# Altium project DO_AN1_project.PrjPCB
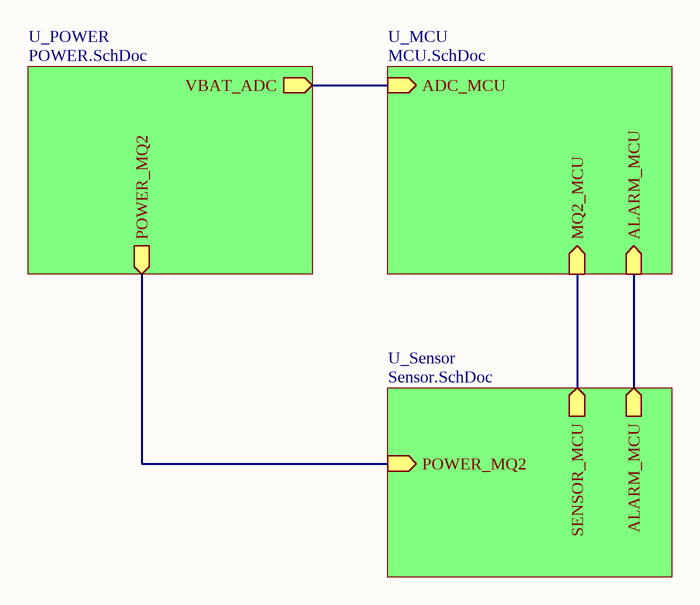
[diagram p0: MutiSheet.SchDoc]
4 sheets, 63 parts. Net scope: hierarchical (ports join the sheet entries above them; power ports are global).
Board files: PCB_DO_AN_1_ver1.PcbDoc, PCB_DO_AN_1_ver2.PcbDoc
Sheets:
  MutiSheet.SchDoc
    U_MCU = MCU.SchDoc
    U_POWER = POWER.SchDoc
    U_Sensor = Sensor.SchDoc

## Sheet MutiSheet.SchDoc
size B

### Sub-sheets
U_MCU = MCU.SchDoc: ADC_MCU (in), ALARM_MCU (in), MQ2_MCU (in)
U_POWER = POWER.SchDoc: VBAT_ADC (out), POWER_MQ2 (out)
U_Sensor = Sensor.SchDoc: ALARM_MCU (out), SENSOR_MCU (out), POWER_MQ2 (in)

### Nets
NetC13#1_2: sheet U_POWER/POWER_MQ2, sheet U_Sensor/POWER_MQ2
NetC14#1_2: sheet U_MCU/ADC_MCU, sheet U_POWER/VBAT_ADC
NetIC1_9: sheet U_MCU/MQ2_MCU, sheet U_Sensor/SENSOR_MCU
NetIC1_33: sheet U_MCU/ALARM_MCU, sheet U_Sensor/ALARM_MCU

## Sheet MCU.SchDoc
size A
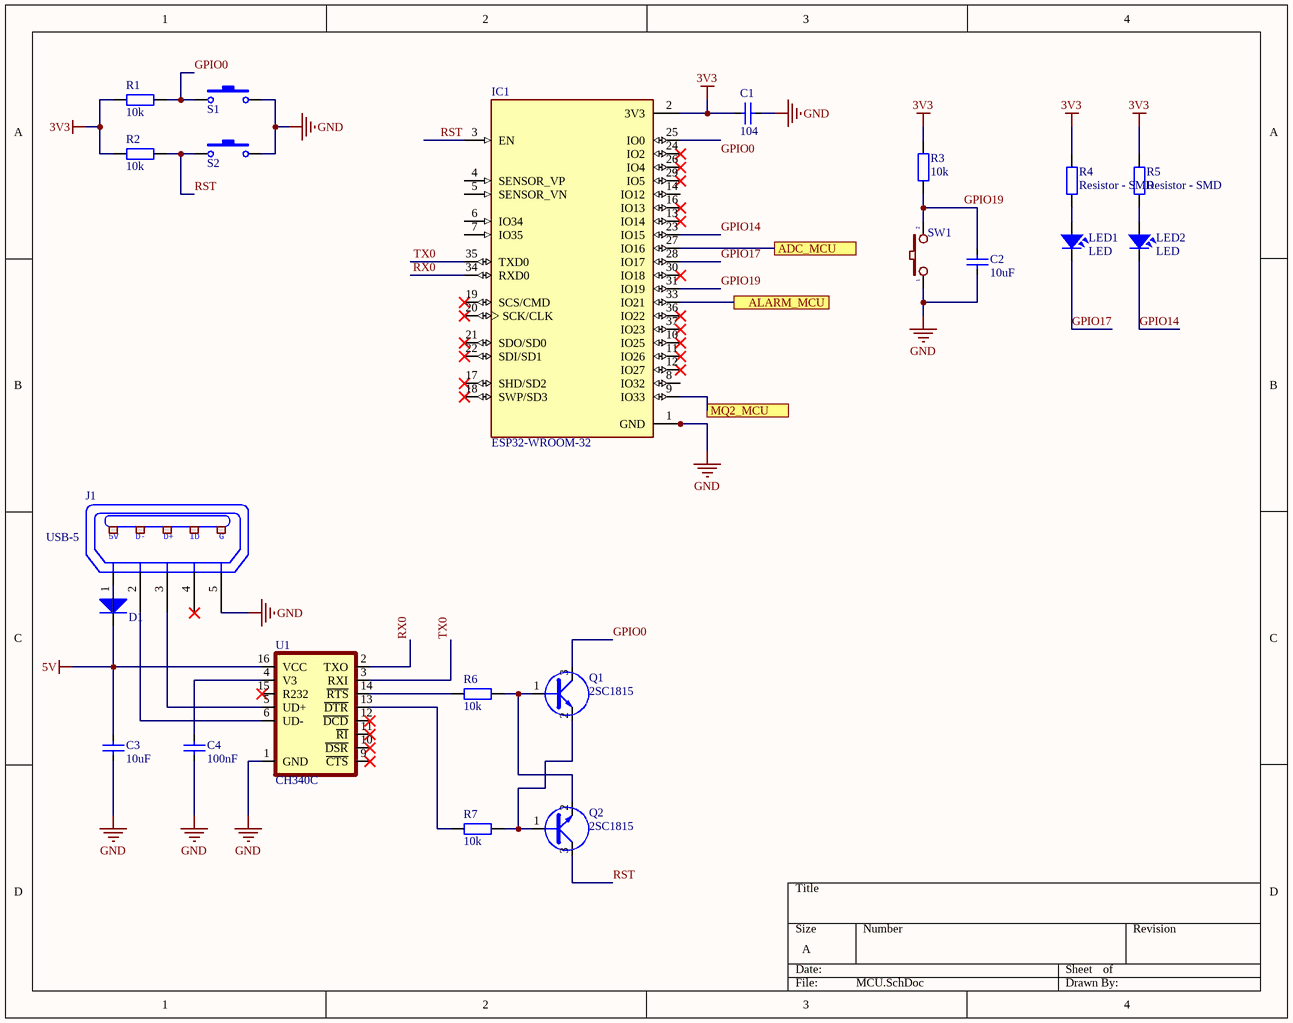
[diagram p1: MCU.SchDoc]

### Parts
C1  104  [CAP_0805]
C2  10uF  [CAP_0805]
C3  10uF  [CAP_0805]
C4  100nF  [CAP_0805]
D1  Diode SMD  [DIO-214AC(SMA)]  (value not drawn)
IC1  ESP32-WROOM-32  [MODULE_ESP32-WROOM-32]
J1  USB-5  [USB-M1]
LED1  LED  [LED-0805-Blue]
LED2  LED  [LED-3]
Q1  2SC1815  [SOT23D]
Q2  2SC1815  [SOT23D]
R1  10k  [RES-SMD-0805]
R2  10k  [RES-SMD-0805]
R3  10k  [RES-SMD-0805]
R4  Resistor - SMD  [RES-SMD-0805]
R5  Resistor - SMD  [RES-SMD-0805]
R6  10k  [RES-SMD-0805]
R7  10k  [RES-SMD-0805]
S1  SW-SMD  [SW 3x2x4]  (value not drawn)
S2  SW-SMD  [SW 3x2x4]  (value not drawn)
SW1  SW  [SW2]  (value not drawn)
U1  CH340C  [SOP-16]

### Ports
ADC_MCU, ALARM_MCU, MQ2_MCU

### Nets
3V3: C1.1 IC1.2(3V3) R1.2 R2.2 R3.1 R4.2 R5.2
5V: C3.2 D1.2(K) U1.16(VCC)
GND: C1.2 C2.1 C3.1 C4.1 IC1.1(GND) IC1.15(GND) IC1.38(GND) IC1.39_1(GND) IC1.39_2(GND) IC1.39_3(GND) IC1.39_4(GND) IC1.39_5(GND) IC1.39_6(GND) IC1.39_7(GND) IC1.39_8(GND) IC1.39_9(GND) IC1.39_10(GND) IC1.39_11(GND) IC1.39_12(GND) IC1.39_13(GND) IC1.39_14(GND) IC1.39_15(GND) IC1.39_16(GND) IC1.39_17(GND) IC1.39_18(GND) IC1.39_19(GND) IC1.39_20(GND) IC1.39_21(GND) J1.5(P5) S1.2 S2.2 SW1.1 U1.1(GND)
GPIO0: IC1.25(IO0) Q1.3(C) R1.1 S1.1
GPIO14: IC1.23(IO15) LED2.2
GPIO17: IC1.28(IO17) LED1.2
GPIO19: C2.2 IC1.31(IO19) R3.2 SW1.2
RST: IC1.3(EN) Q2.3(C) R2.1 S2.1
RX0: IC1.34(RXD0) U1.2(TXO)
TX0: IC1.35(TXD0) U1.3(RXI)
NetC4_2: C4.2 U1.4(V3)
NetC14#1_2: IC1.27(IO16) ; port ADC_MCU
NetD1_1: D1.1(A) J1.1(P1)
NetIC1_9: IC1.9(IO33) ; port MQ2_MCU
NetIC1_33: IC1.33(IO21) ; port ALARM_MCU
NetJ1_2: J1.2(P2) U1.6(UD-)
NetJ1_3: J1.3(P3) U1.5(UD+)
NetLED1_1: LED1.1 R4.1
NetLED2_1: LED2.1 R5.1
NetQ1_1: Q1.1(B) Q2.2(E) R6.1
NetQ1_2: Q1.2(E) Q2.1(B) R7.1
NetR6_2: R6.2 U1.14(~{RTS})
NetR7_2: R7.2 U1.13(~{DTR})

Not connected (* = marked no-connect by the designer): IC1 4(SENSOR_VP) 5(SENSOR_VN) 6(IO34) 7(IO35) 8(IO32) 10(IO25)* 11(IO26)* 12(IO27)* 13(IO14)* 14(IO12) 16(IO13)* 17(SHD/SD2)* 18(SWP/SD3)* 19(SCS/CMD)* 20(SCK/CLK)* 21(SDO/SD0)* 22(SDI/SD1)* 24(IO2)* 26(IO4)* 29(IO5)* 30(IO18)* 36(IO22)* 37(IO23)*; J1 4(P4)*; U1 9(~{CTS})* 10(~{DSR})* 11(~{RI})* 12(~{DCD})* 15(R232)*

### Notes on the sheet
- (in symbol USB-5) 5V; D-; D+; ID; G

### Library data of the parts
C1-C4 = CapSMD: Capacitor; Value: 33p; Published: 8-Jun-2000; LatestRevisionDate: 17-Jul-2002; LatestRevisionNote: Re-released for DXP Platform.; PackageReference: RAD-0.3; Publisher: Altium Limited
D1 = Diode SMD: Default Diode; Code - JEDEC: DO-214-AB; Value: 1N5007; Published: 8-Jun-2000; Revision: July-2002: Re-released for DXP Platform.; Publisher: Altium Limited
IC1 = ESP32-WROOM-32: Bluetooth, WiFi Transceiver Module 2.4GHz ~ 2.5GHz Surface Mount; MF: Espressif Systems; Package: Module Espressif Systems; Digi-Key_Part_Number: 1904-1010-1-ND; Digi-Key_Purchase_URL: https://www.digikey.com/product-detail/en/espressif-systems/ESP32-WROOM-32/1904-1010-1-ND/8544305?utm_source=snapeda&utm_medium=aggregator&utm_campaign=symbol; Value: *; MP: ESP32-WROOM-32; SnapEDA_Link: https://www.snapeda.com/parts/ESP32-WROOM-32/Espressif%20Systems/view-part/2753322/?ref=snap
J1 = USB-5: Manufacturer: FCI; Manufacturer Part Number: 10118193-0001LF; Connector Type: USB - micro B; Number of Contacts: 5; Gender: Receptacle; Specifications: USB 2.0; .Creator: MM; .Checked PCB: RF; Supplier 1: Digi-Key; RoHS: RoHS Compliant; Category: Connectors, Interconnects; Stock 1: 28642; Pricing 1: 1=0.46, 10=0.433, 25=0.3712, 50=0.3156, 100=0.3032, 250=0.27224, 500=0.25988 (USD); Packaging: Cut Tape (CT); Mounting Type: Surface Mount, Right Angle, Horizontal; Features: Shielded, Solder Retention; Ingress Protection: -; ComponentLink1URL: http://portal.fciconnect.com/Comergent//fci/drawing/10118193.pdf; ComponentLink1Description: http://portal.fciconnect.com/Comergent//fci/drawing/10118193.pdf; Supplier Part Number 1: 609-4616-1-ND; .Checked SCH: MM
LED1 LED2 = LED: LED Single colour Green and Red; Value: LED 3 ly Single Colour
Q1 Q2 = C1815: NPN 600mW, ECB; Value: C1815
R1-R7 = Resistor - SMD: Resistor SMD; Manufacturer: Generic Components; Class: Passive; Published: 08/06/2000; Publisher: Altium Hobart Technology Centre
S1 S2 = SW-SMD: Switch; Published: 24-Mar-1999; LatestRevisionDate: 17-Jul-2002; LatestRevisionNote: Re-released for DXP Platform.; PackageReference: SPST-2; Publisher: Altium Limited
SW1 = SW2: Switch button 2 pin; Value: SW chip 2 pin
U1 = CH340C: USB to serial chip CH340; MF: WCH; Package: Package; Check_prices: https://www.snapeda.com/parts/CH340C/WCH/view-part/5428851/?ref=eda; Value: *; Price: None; MP: CH340C; Availability: Unavailable; SnapEDA_Link: https://www.snapeda.com/parts/CH340C/WCH/view-part/5428851/?ref=snap

## Sheet POWER.SchDoc
size B
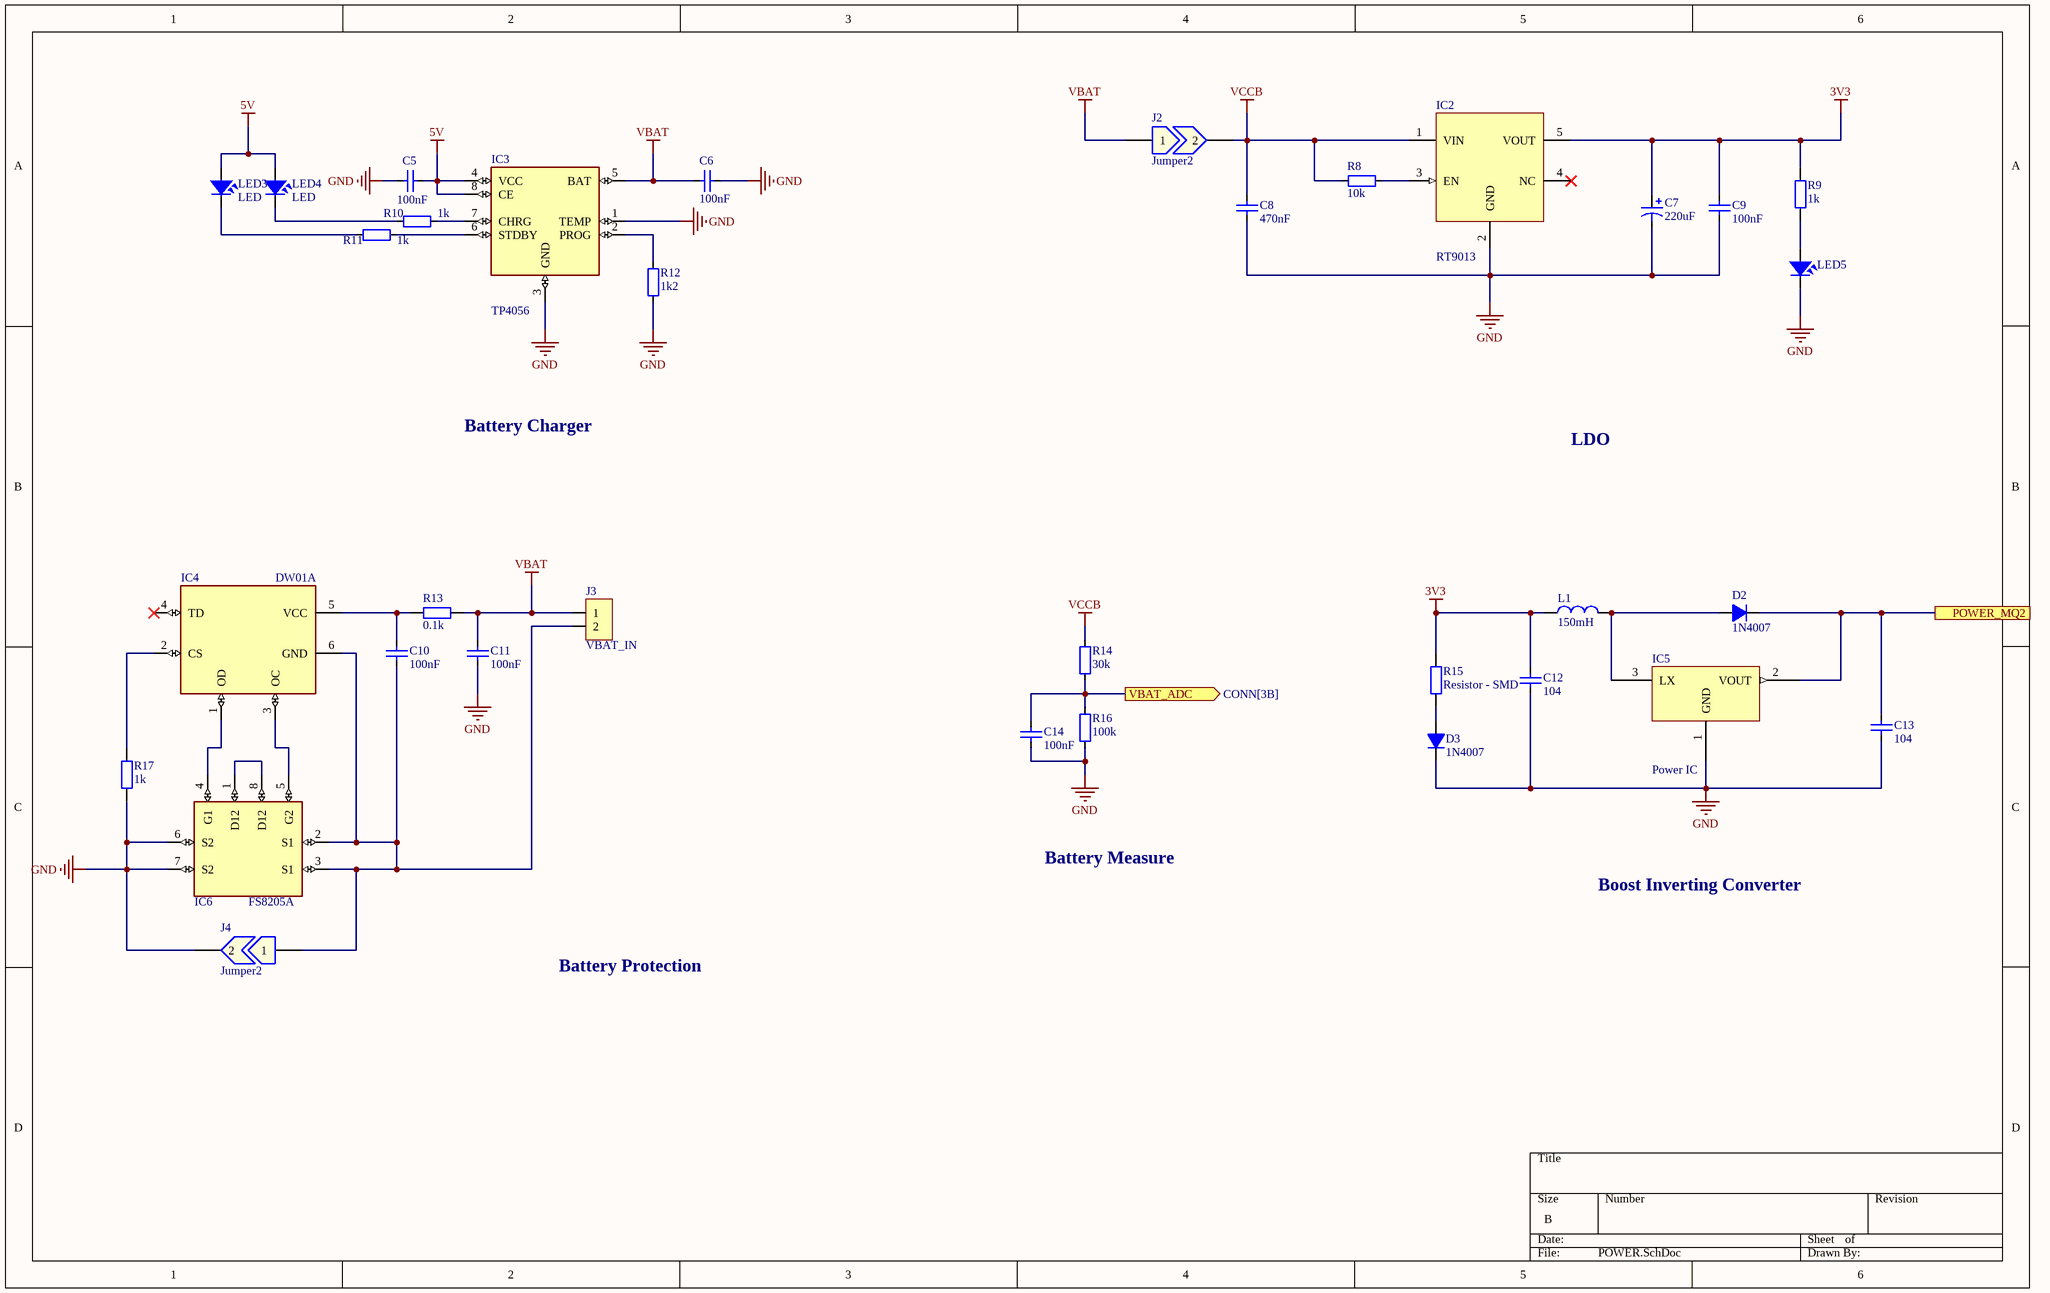
[diagram p2: POWER.SchDoc]

### Parts
(Parts that share a designator on the sheet are numbered #1, #2 ... from top to bottom, then left to right.)
C5  100nF  [CAP_0805]
C6  100nF  [CAP_0805]
C7  220uF  [CAP_TANTALUM_3216]
C8  470nF  [CAP_0805]
C9  100nF  [CAP_0805]
C10  100nF  [CAP_0805]
C11  100nF  [CAP_0805]
C12  104  [CAP_0805]
C13#1  104  [CAP_0805]
C14#1  100nF  [CAP_0805]
D2  1N4007  [D1A]
D3  1N4007  [D1A]
IC2  RT9013  [SOT23-5]
IC3  TP4056  [TP4056]
IC4  DW01A  [SOT23-6]
IC5  Power IC  [SOT-89-3]
IC6  FS8205A  [FS8205A]
J2  Jumper2  [JUMPER2]
J3  VBAT_IN  [JP2-D1T]
J4  Jumper2  [JUMPER2]
L1  150mH  [L/0.4]
LED3  LED  [LED-0805-Red]
LED4  LED  [LED-0805-Green]
LED5  (no value)  [LED-0805-Red]
R8  10k  [RES-SMD-0805]
R9  1k  [RES-SMD-0805]
R10  1k  [RES-SMD-0805]
R11  1k  [RES-SMD-0805]
R12  1k2  [RES-SMD-0805]
R13  0.1k  [RES-SMD-0805]
R14  30k  [RES-SMD-0805]
R15  Resistor - SMD  [RES-SMD-0805]
R16  100k  [RES-SMD-0805]
R17#1  1k  [RES-SMD-0805]

### Ports
POWER_MQ2, VBAT_ADC (out, see CONN[3B])

### Nets
3V3: C7.1 C9.1 C12.1 IC2.5(VOUT) L1.1 R9.2 R15.1
5V: C5.1 IC3.4(VCC) IC3.8(CE) LED3.1 LED4.1
GND: C5.2 C6.1 C7.2 C8.2 C9.2 C11.1 C12.2 C13#1.1 C14#1.1 D3.2(K) IC2.2(GND) IC3.1(TEMP) IC3.3(GND) IC5.1(GND) IC6.6(S2) IC6.7(S2) J4.2 LED5.2 R12.1 R16.2 R17#1.2
VBAT: C6.2 C11.2 IC3.5(BAT) J2.1 J3.1 R13.2
VCCB: C8.1 IC2.1(VIN) J2.2 R8.2 R14.1
NetC10_1: C10.1 IC4.6(GND) IC6.2(S1) IC6.3(S1) J3.2 J4.1
NetC10_2: C10.2 IC4.5(VCC) R13.1
NetC13#1_2: C13#1.2 D2.2(K) IC5.2(VOUT) ; port POWER_MQ2
NetC14#1_2: C14#1.2 R14.2 R16.1 ; port VBAT_ADC
NetD2_1: D2.1(A) IC5.3(LX) L1.2
NetD3_1: D3.1(A) R15.2
NetIC2_3: IC2.3(EN) R8.1
NetIC3_2: IC3.2(PROG) R12.2
NetIC3_6: IC3.6(STDBY) R11.1
NetIC3_7: IC3.7(CHRG) R10.1
NetIC4_1: IC4.1(OD) IC6.4(G1)
NetIC4_2: IC4.2(CS) R17#1.1
NetIC4_3: IC4.3(OC) IC6.5(G2)
NetIC6_1: IC6.1(D12) IC6.8(D12)
NetLED3_2: LED3.2 R11.2
NetLED4_2: LED4.2 R10.2
NetLED5_1: LED5.1 R9.1

Not connected (* = marked no-connect by the designer): IC2 4(NC)*; IC4 4(TD)*

### Notes on the sheet
- Battery Charger
- LDO
- Battery Measure
- Boost Inverting Converter
- Battery Protection

### Library data of the parts
C5 C6 C8-C12 C13#1 C14#1 = CapSMD: Capacitor; Value: 33p; Published: 8-Jun-2000; LatestRevisionDate: 17-Jul-2002; LatestRevisionNote: Re-released for DXP Platform.; PackageReference: RAD-0.3; Publisher: Altium Limited
C7 = Cap Pol: Polarized Capacitor (Axial); Published: 8-Jun-2000; LatestRevisionDate: 17-Jul-2002; LatestRevisionNote: Re-released for DXP Platform.; PackageReference: POLAR0.8; Publisher: Altium Limited
D2 D3 = D1A: Diode 1A; Value: 1N4007
IC2 = RT9013: https://linhkien.cxt.vn/5435-rt9013-33gb-ic-reg-linear-33v-500ma-sot23-5.html
IC3 = TP4056: Complete single cell Li-Ion battery with a constant current / constant voltage linear charger
IC4 = DW01A: One Cell Lithium-ion/Polymer Battery Protection IC
IC5 = CE8301A/BL8530: Boost 5V IC 500mA
J2 J4 = Jumper2: Jumper, 2-Pin
J3 = JP2: WR-PHD 2.54 mm Angled Socket Header; Manufacturer: W¨¹rth Elektronik eiSos GmbH; partNo: 613002143121; ComponentLink1 Description: Manufacturer; ComponentLink2 Description: Datasheet; NoPins: 02; Created Date: 29 March 2013; ComponentLink1URL: http://www.we-online.com; ComponentLink2URL: http://katalog.we-online.de/em/datasheet/6130xx143121.pdf; Created by: Karrer Zheng
L1 = L1: Inductor; Value: 150 mH
LED3-LED5 = LED: as LED1 on sheet MCU
R8 R10-R12 R14 R16 = Resistor - SMD: Resistor; Manufacturer: Generic Components; Class: Passive; Published: 08/06/2000; Publisher: Altium Hobart Technology Centre
R9 R13 R15 R17#1 = Resistor - SMD: as R1 on sheet MCU; Published: 08/06/2000; Publisher: Altium Hobart Technology Centre

## Sheet Sensor.SchDoc
size A
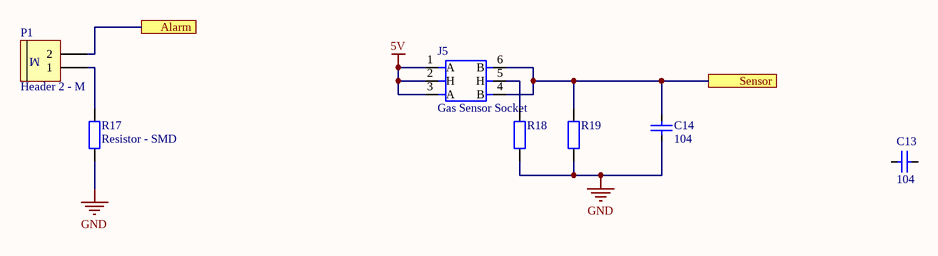
[diagram p3: Sensor.SchDoc]

### Parts
(Parts that share a designator on the sheet are numbered #1, #2 ... from top to bottom, then left to right.)
C13#2  104  [CAP_0402]
C14#2  104  [CAP_0805]
J5  Gas Sensor Socket  [MQ2]
P1  Header 2 - M  [Medium - Header 2]
R17#2  Resistor - SMD  [RES-SMD-0805]
R18  Resistor - SMD  [RES-SMD-0805]  (value not drawn)
R19  Resistor - SMD  [RES-SMD-0805]  (value not drawn)

### Ports
Alarm, Sensor

### Nets
5V: J5.1(A) J5.2(H) J5.3(A)
GND: C14#2.1 R17#2.2 R18.2 R19.2
NetC14#2_2: C14#2.2 J5.4(B) J5.6(B) R19.1 ; port Sensor
NetJ5_5: J5.5(H) R18.1
NetP1_1: P1.1 R17#2.1
NetP1_2: P1.2 ; port Alarm

Not connected (* = marked no-connect by the designer): C13#2 1 2

### Notes on the sheet
- (in symbol Header 2 - M) M

### Library data of the parts
C13#2 C14#2 = CapSMD: Capacitor; Value: 33p; Published: 8-Jun-2000; LatestRevisionDate: 17-Jul-2002; LatestRevisionNote: Re-released for DXP Platform.; PackageReference: RAD-0.3; Publisher: Altium Limited
J5 = MQ2
P1 = Header 2 - M: Header, 2-Pin, Medium; LatestRevisionDate: 17-Jul-2002; LatestRevisionNote: Re-released for DXP Platform.; Publisher: Altium Limited
R17#2 R18 R19 = Resistor - SMD: as R1 on sheet MCU; Published: 08/06/2000; Publisher: Altium Hobart Technology Centre

## Nets that join several sheets
3V3: MCU (7 pins), POWER (7 pins)
5V: MCU (C3.2 D1.2 U1.16), POWER (5 pins), Sensor (J5.1 J5.2 J5.3)
GND: MCU (33 pins), POWER (21 pins), Sensor (C14#2.1 R17#2.2 R18.2 R19.2)
NetC14#1_2: MCU (IC1.27), POWER (C14#1.2 R14.2 R16.1)